# Altium schematic sheet RS485NFlash.SchDoc
size A4; SheetNumber: 7; SheetTotal: 7
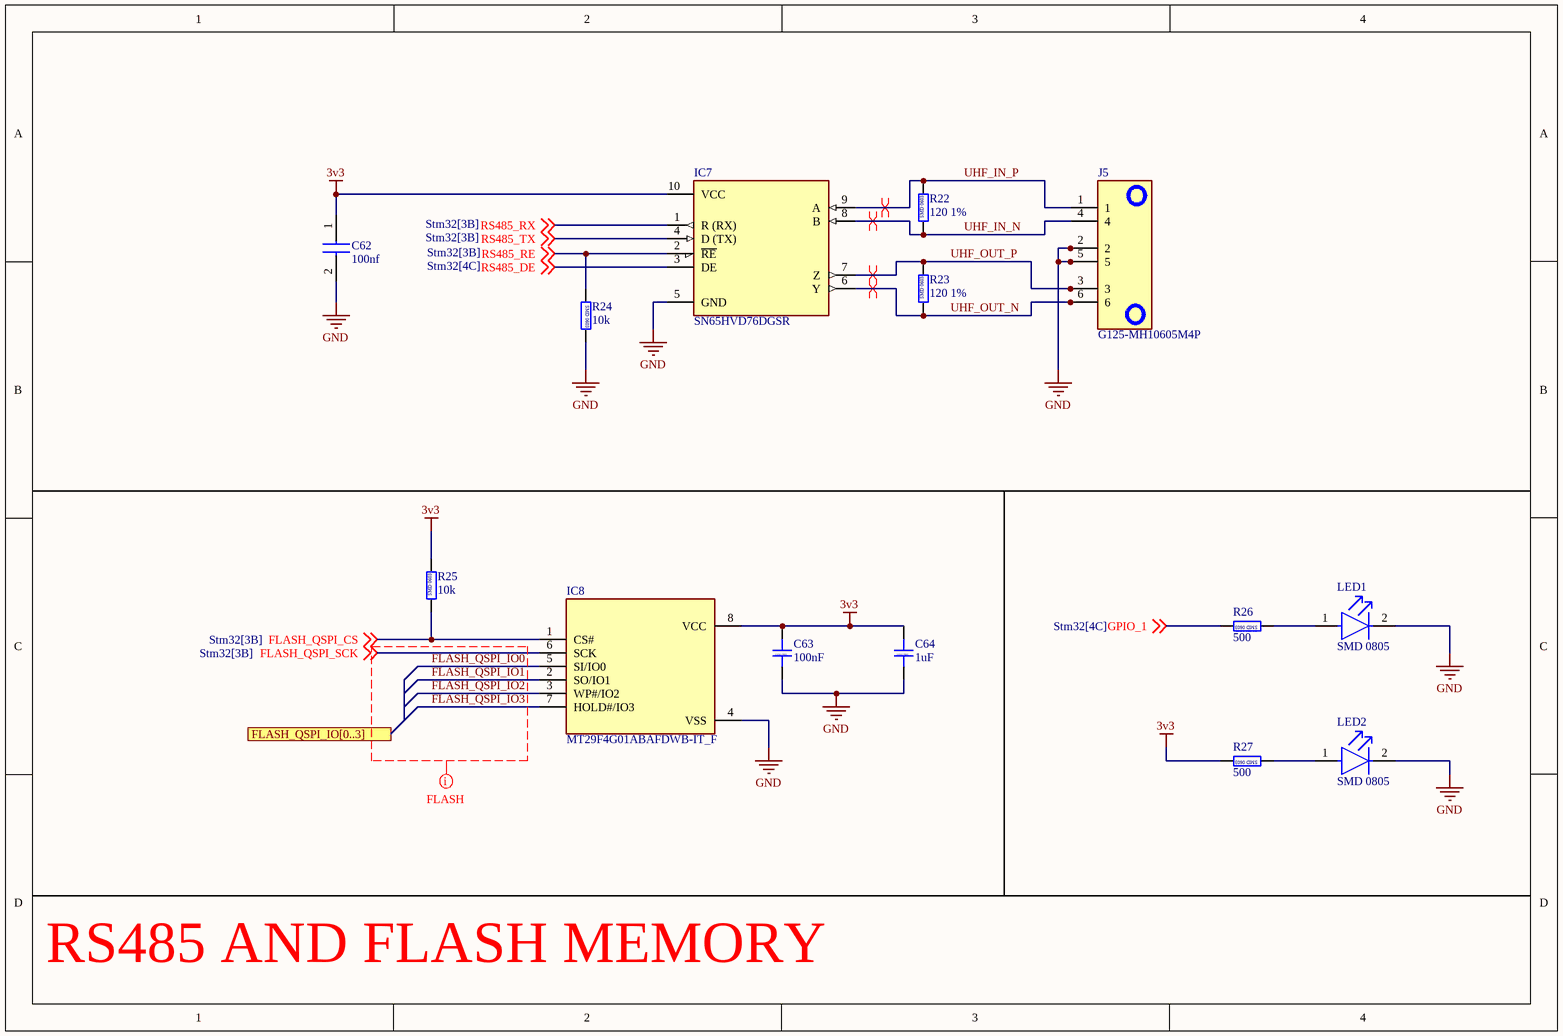
[diagram p0: RS485NFlash.SchDoc]

## Parts
C62  100nf  [CAPC1608X87N]
C63  100nF  [CAP_0603]
C64  1uF  [CAP_0603]
IC7  SN65HVD76DGSR  [SOP50P490X110-10N]
IC8  MT29F4G01ABAFDWB-IT_F  [SON127P800X600X65-8N]
J5  G125-MH10605M4P  [G125-MH10605M4P_1]
LED1  SMD 0805  [FP-SM0805YCL-MFG]
LED2  SMD 0805  [FP-SM0805YCL-MFG]
R22  120 1%  [RES_0603]
R23  120 1%  [RES_0603]
R24  10k  [RES_0603]
R25  10k  [RES_0603]
R26  500  [RES_0603]
R27  500  [RES_0603]

## Ports
FLASH_QSPI_IO[0..3]

## Nets
3v3: C62.1 C63.2 C64.2 IC7.10(VCC) IC8.8(VCC) R25.2 R27.2
GND: C62.2 C63.1 C64.1 IC7.5(GND) IC8.4(VSS) J5.2 J5.5 LED1.2(C) LED2.2(C) R24.2
FLASH_QSPI_CS: IC8.1(CS#) R25.1 ; off-sheet FLASH_QSPI_CS
FLASH_QSPI_IO0: IC8.5(SI/IO0)
FLASH_QSPI_IO1: IC8.2(SO/IO1)
FLASH_QSPI_IO2: IC8.3(WP#/IO2)
FLASH_QSPI_IO3: IC8.7(HOLD#/IO3)
FLASH_QSPI_SCK: IC8.6(SCK) ; off-sheet FLASH_QSPI_SCK
GPIO_1: R26.2 ; off-sheet GPIO_1
RS485_DE: IC7.3(DE) ; off-sheet RS485_DE
RS485_RE: IC7.2(~{RE}) R24.1 ; off-sheet RS485_RE
RS485_RX: IC7.1(R_(RX)) ; off-sheet RS485_RX
RS485_TX: IC7.4(D_(TX)) ; off-sheet RS485_TX
UHF_IN_N: IC7.8(B) J5.4 R22.1
UHF_IN_P: IC7.9(A) J5.1 R22.2
UHF_OUT_N: IC7.6(Y) J5.6 R23.1
UHF_OUT_P: IC7.7(Z) J5.3 R23.2
NetLED1_1: LED1.1(A) R26.1
NetLED2_1: LED2.1(A) R27.1

## Layout directives
differential pair: UHF_IN_N, UHF_IN_P, UHF_OUT_N, UHF_OUT_P
net class FLASH: FLASH_QSPI_IO0, FLASH_QSPI_IO1, FLASH_QSPI_IO2, FLASH_QSPI_IO3, FLASH_QSPI_SCK

## Notes on the sheet
- RS485 AND FLASH MEMORY
- (in symbol Capacitor-SMD-0603) SMD 0603
- (in symbol Resistor-SMD-0603) SMD 0603

## Library data of the parts
C62 = 0603N470J500CT: Capacitor; Manufacturer_Name: Walsin Technology Corporation; Datasheet Link: https://datasheet.datasheetarchive.com/originals/distributors/DKDS41/DSANUWW0027552.pdf; Height: 0.87mm; Manufacturer_Part_Number: 0603N470J500CT; Mouser Part Number: 791-0603N470J500CT; Mouser Price/Stock: https://www.mouser.co.uk/ProductDetail/Walsin/0603N470J500CT?qs=ZrPdAQfJ6DOWJe9N0xQVbw%3D%3D
C63 C64 = Capacitor-SMD-0603: Capacitor SMD 0603 RATED
IC7 = SN65HVD76DGSR: RS485 Full Duplex Transciever; Manufacturer_Name: Texas Instruments; Datasheet Link: http://www.ti.com/lit/gpn/sn65hvd76; Height: 1.1mm; Manufacturer_Part_Number: SN65HVD76DGSR; Mouser Part Number: 595-SN65HVD76DGSR; Mouser Price/Stock: https://www.mouser.co.uk/ProductDetail/Texas-Instruments/SN65HVD76DGSR?qs=7z%252BmIopC6%2FI%252B8LLIzcebYw%3D%3D; Arrow Part Number: SN65HVD76DGSR; Arrow Price/Stock: https://www.arrow.com/en/products/sn65hvd76dgsr/texas-instruments?region=nac
IC8 = MT29F4G01ABAFDWB-IT_F: Integrated Circuit; Manufacturer_Name: Micron; Manufacturer_Part_Number: MT29F4G01ABAFDWB-IT:F; Datasheet Link: https://www.farnell.com/datasheets/3151403.pdf; Height: 0.65mm; Mouser Part Number: 340-359563; Mouser Price/Stock: https://www.mouser.co.uk/ProductDetail/Micron/MT29F4G01ABAFDWB-ITF?qs=wUXugUrL1qwrjb7To7JPbA%3D%3D; Arrow Part Number: MT29F4G01ABAFDWB-IT:F; Arrow Price/Stock: null?region=nac
J5 = G125-MH10605M4P: Connector; Manufacturer_Name: Harwin; Datasheet Link: https://content.harwin.com/m/667f1be9427fb768/original/DRG-02921-Technical-Drawing-Datasheet-G125-MH1XX05M4P-pdf.pdf; Height: 5.3mm; Manufacturer_Part_Number: G125-MH10605M4P; Mouser Part Number: 855-G125MH1065M4PM4P; Mouser Price/Stock: https://www.mouser.co.uk/ProductDetail/Harwin/G125-MH10605M4P?qs=vHuUswq2%252BswF07IXFR1W6A%3D%3D
LED1 LED2 = CMP-35283-000007-1: LED YELLOW CLEAR 0805 SMD; Luminous Intensity: 11.5mcd; Test Current: 2mA; Viewing Angle: 130°; Dominant Wavelength: 592nm; Forward Voltage: 1.9V; Lens Color: Colorless; Case Code (Metric): 2012; Illumination Color: Yellow; Length: 2mm; Max Operating Temperature: 80°C; Width: 1.2mm; Case Code (Imperial): 0805; Packaging: Tape and Reel; Lens Transparency: Clear; Mount: Surface Mount; Case/Package: 0805; Forward Current: 2mA; Height: 0.8mm; Lead Free: Lead Free; Min Operating Temperature: -30°C; Color: Yellow; Package Quantity: 4000
R22-R27 = Resistor-SMD-0603: Resistor SMD 0603 RATED